# Altium schematic sheet PWM_Generator.SchDoc
size A
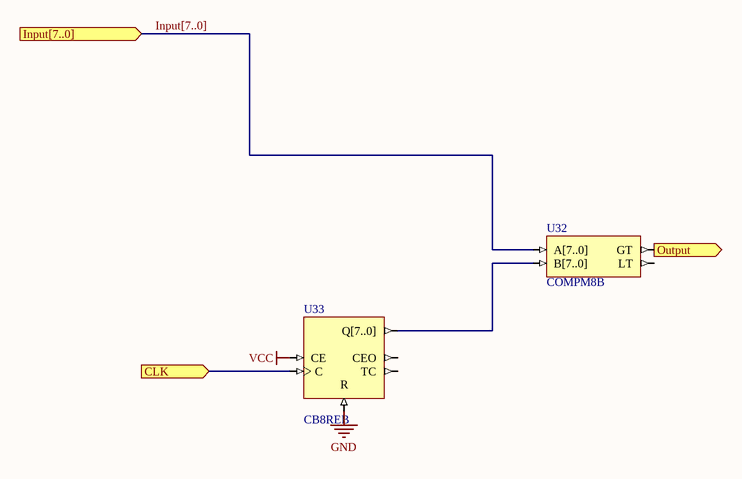
[diagram p0: PWM_Generator.SchDoc]

## Parts
U32  COMPM8B
U33  CB8REB

## Ports
CLK (in), Input[7..0] (in), Output (out)

## Nets
GND: U33.R
VCC: U33.CE
CLK: U33.C ; port CLK
Input[7..0]: U32.A[7..0] ; port Input[7..0]
Output: U32.GT ; port Output
NetU32_B[7..0]: U32.B[7..0] U33.Q[7..0]

Not connected (* = marked no-connect by the designer): U32 LT; U33 CEO TC

## Buses and harness runs
bus Input[7..0] = port Input[7..0]

## Library data of the parts
U32 = COMPM8B: 8-Bit Magnitude Comparator, Bus Version; XilinxEquivalent: COMPM8; SubClass: COMPM; PortSize: 8; ArchiveName: GENERIC; VHDLIB_SIM: GENERIC_LIB; Published: 29-Jan-2004; Publisher: Altium Limited; LastRevisionNo: 1.00.00; HelpURL: CR0118 FPGA Generic Library Guide.pdf#page=153; ComponentLink1URL: CR0129 FPGA Comparator Resource Usage.pdf#page=37; ComponentLink1Description: Core &Resource Usage; FunctionalClass: Comparator; PortStyle: Bus Version
U33 = CB8REB: 8-Bit Cascadable Binary Counter with Clock Enable and Synchronous Reset, Bus Version; XilinxEquivalent: CB8RE; ClockTrigger: Rising; Enable: High; PortSize: 8; ArchiveName: GENERIC; VHDLIB_SIM: GENERIC_LIB; Published: 29-Jan-2004; Publisher: Altium Limited; LastRevisionNo: 1.00.00; HelpURL: CR0118 FPGA Generic Library Guide.pdf#page=134; ComponentLink1URL: CR0130 FPGA Counter Resource Usage.pdf#page=29; ComponentLink1Description: Core &Resource Usage; FunctionalClass: Counter; SubClass: Binary; Reset: Synchronous; PortType: Bus Version